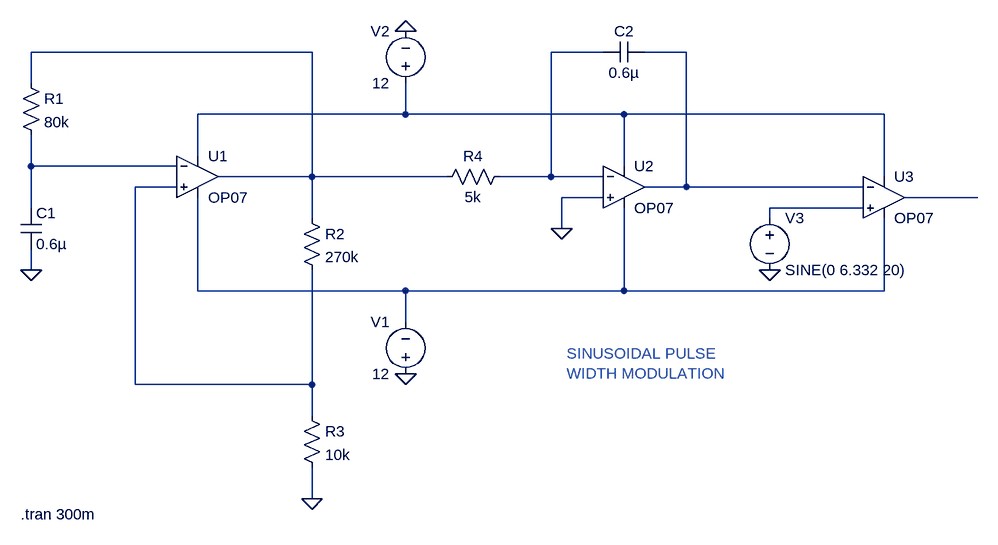
[diagram p0: schematic Sinusoidal pulse width modulation.asc]
Sinusoidal pulse width modulation.asc, the LTspice schematic file:
Version 4
SHEET 1 1440 712
WIRE 400 -16 -32 -16
WIRE 848 -16 768 -16
WIRE 976 -16 912 -16
WIRE -32 32 -32 -16
WIRE 544 80 544 32
WIRE 544 80 224 80
WIRE 880 80 544 80
WIRE 1280 80 880 80
WIRE 224 144 224 80
WIRE -32 160 -32 112
WIRE 192 160 -32 160
WIRE 880 160 880 80
WIRE 400 176 400 -16
WIRE 400 176 256 176
WIRE 608 176 400 176
WIRE 768 176 768 -16
WIRE 768 176 688 176
WIRE 848 176 768 176
WIRE 1280 176 1280 80
WIRE 192 192 128 192
WIRE 976 192 976 -16
WIRE 976 192 912 192
WIRE 1248 192 976 192
WIRE 848 208 784 208
WIRE 1424 208 1312 208
WIRE -32 224 -32 160
WIRE 1248 224 1104 224
WIRE 400 240 400 176
WIRE 1104 240 1104 224
WIRE 784 256 784 208
WIRE -32 320 -32 288
WIRE 224 352 224 208
WIRE 544 352 224 352
WIRE 880 352 880 224
WIRE 880 352 544 352
WIRE 1280 352 1280 240
WIRE 1280 352 880 352
WIRE 544 400 544 352
WIRE 128 496 128 192
WIRE 400 496 400 320
WIRE 400 496 128 496
WIRE 400 544 400 496
WIRE 400 672 400 624
FLAG -32 320 0
FLAG 400 672 0
FLAG 544 480 0
FLAG 544 -48 0
FLAG 784 256 0
FLAG 1104 320 0
SYMBOL OpAmps\\OP07 224 112 R0
SYMATTR InstName U1
SYMBOL res -48 16 R0
SYMATTR InstName R1
SYMATTR Value 80k
SYMBOL res 384 224 R0
SYMATTR InstName R2
SYMATTR Value 270k
SYMBOL res 384 528 R0
SYMATTR InstName R3
SYMATTR Value 10k
SYMBOL cap -48 224 R0
SYMATTR InstName C1
SYMATTR Value 0.6µ
SYMBOL OpAmps\\OP07 880 128 R0
SYMATTR InstName U2
SYMBOL res 704 160 R90
WINDOW 0 0 56 VBottom 2
WINDOW 3 32 56 VTop 2
SYMATTR InstName R4
SYMATTR Value 5k
SYMBOL cap 912 -32 R90
WINDOW 0 0 32 VBottom 2
WINDOW 3 32 32 VTop 2
SYMATTR InstName C2
SYMATTR Value 0.6µ
SYMBOL voltage 544 496 R180
WINDOW 0 24 96 Left 2
WINDOW 3 24 16 Left 2
WINDOW 123 0 0 Left 0
WINDOW 39 0 0 Left 0
SYMATTR InstName V1
SYMATTR Value 12
SYMBOL voltage 544 48 R180
WINDOW 0 24 96 Left 2
WINDOW 3 24 16 Left 2
WINDOW 123 0 0 Left 0
WINDOW 39 0 0 Left 0
SYMATTR InstName V2
SYMATTR Value 12
SYMBOL OpAmps\\OP07 1280 144 R0
SYMATTR InstName U3
SYMBOL voltage 1104 224 R0
WINDOW 123 0 0 Left 0
WINDOW 39 0 0 Left 0
SYMATTR InstName V3
SYMATTR Value SINE(0 6.332 20)
TEXT -48 696 Left 2 !.tran 300m
TEXT 792 448 Left 2 ;SINUSOIDAL PULSE \nWIDTH MODULATION

The netlist it stands for:
* Sinusoidal pulse width modulation.asc
XU1 N006 N005 N004 N009 N001 LT1001  ; OP07, pins In+ In- V+ V- OUT
R1 N001 N005 80k
R2 N001 N006 270k
R3 N006 0 10k
C1 N005 0 0.6µ
XU2 0 N002 N004 N009 N003 LT1001  ; OP07, pins In+ In- V+ V- OUT
R4 N002 N001 5k
C2 N003 N002 0.6µ
V1 0 N009 12
V2 N004 0 12
XU3 N008 N003 N004 N009 N007 LT1001  ; OP07, pins In+ In- V+ V- OUT
V3 N008 0 SINE(0 6.332 20)
.tran 300m
* SINUSOIDAL PULSE
* WIDTH MODULATION
.lib LTC.lib
.backanno
.end